# EAGLE schematic ParticlePhoton (EAGLE 9.6.2)
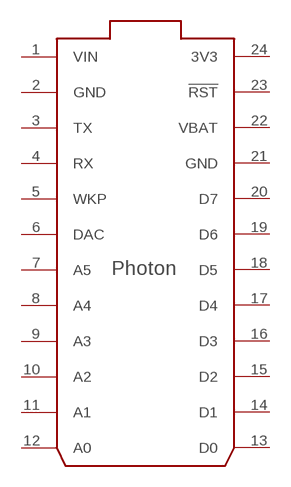
[diagram p0: schematic, sheet 1]

## Parts
U$1  PHOTON_WITH_HEADERS  [PHOTON]
Unconnected: U$1.3(TX) U$1.4(RX) U$1.5(WKP) U$1.6(DAC) U$1.7(A5) U$1.8(A4) U$1.9(A3) U$1.10(A2) U$1.11(A1) U$1.12(A0) U$1.13(D0) U$1.14(D1) U$1.15(D2) U$1.16(D3) U$1.17(D4) U$1.18(D5) U$1.19(D6) U$1.20(D7) U$1.23(!RST)

## Power pins joined to a net without a drawn wire
3V3: U$1.24(3V3)
GND: U$1.2(GND) U$1.21(GND)
VBAT: U$1.22(VBAT)
VIN: U$1.1(VIN)

## Library data of the parts
U$1 = Particle-Devices:PHOTON: Particle Photon Wi-Fi through-hole development board footprint Product datasheet: here <https://docs.particle.io/datasheets/photon-(wifi)/photon-datasheet/> Design files: here <https://github.com/particle-iot/photon> Github : Particle devices library <https://github.com/particle-iot/hardware-libraries/tree/master/Eagle>

## Module BATTERY_BABYSITTER
Ports: 

### Library data of the parts